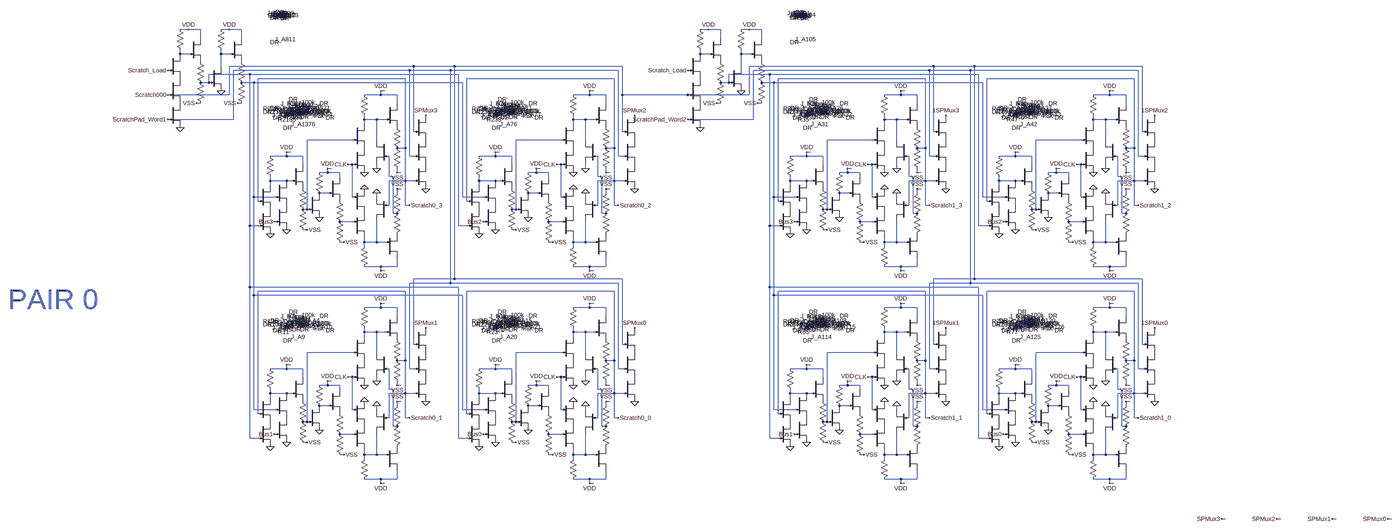
[diagram p0: schematic Pair 1.asc, whole sheet]
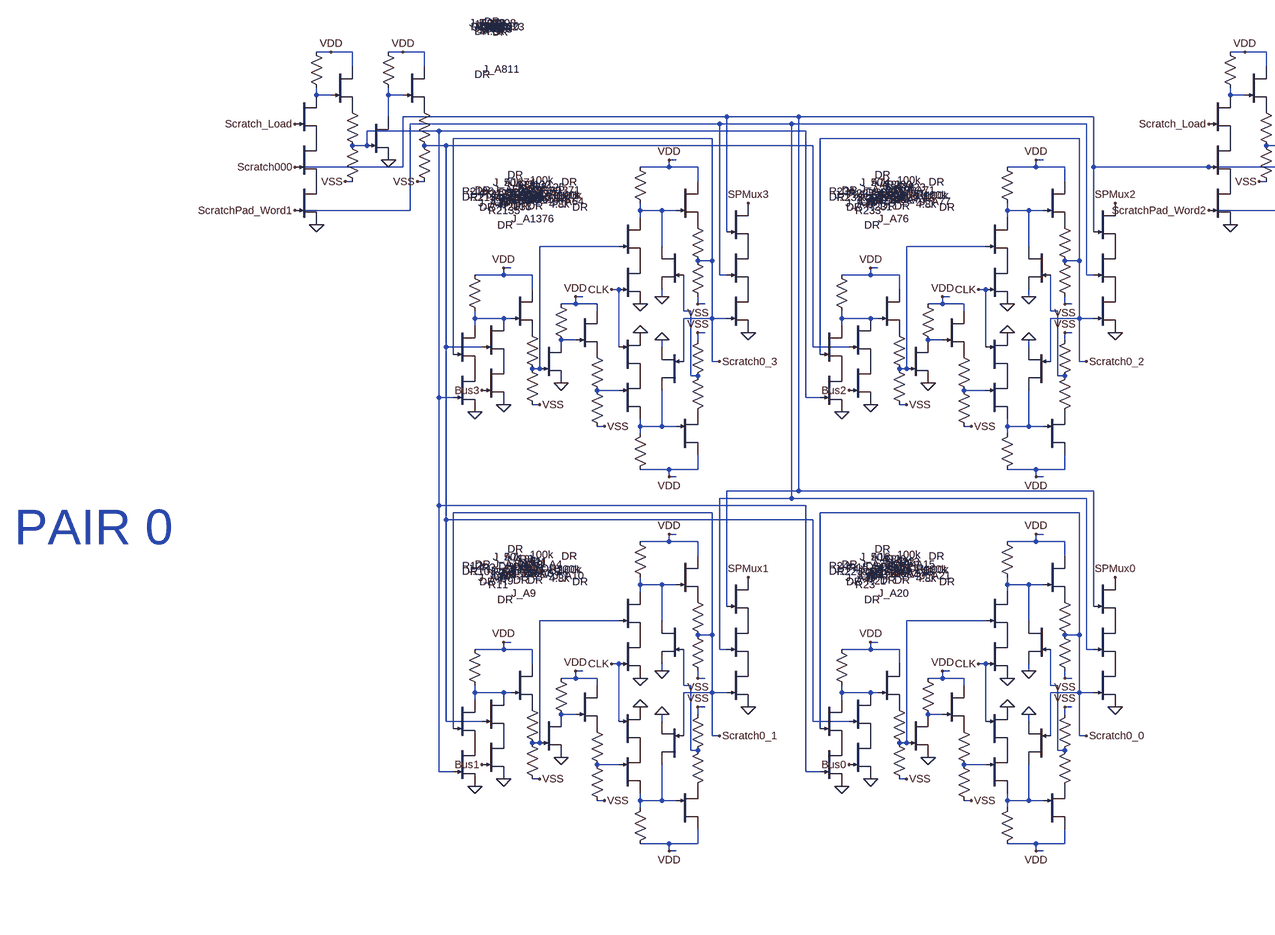
[diagram p1: schematic Pair 1.asc, part, row 1 of 1, column 1 of 2]
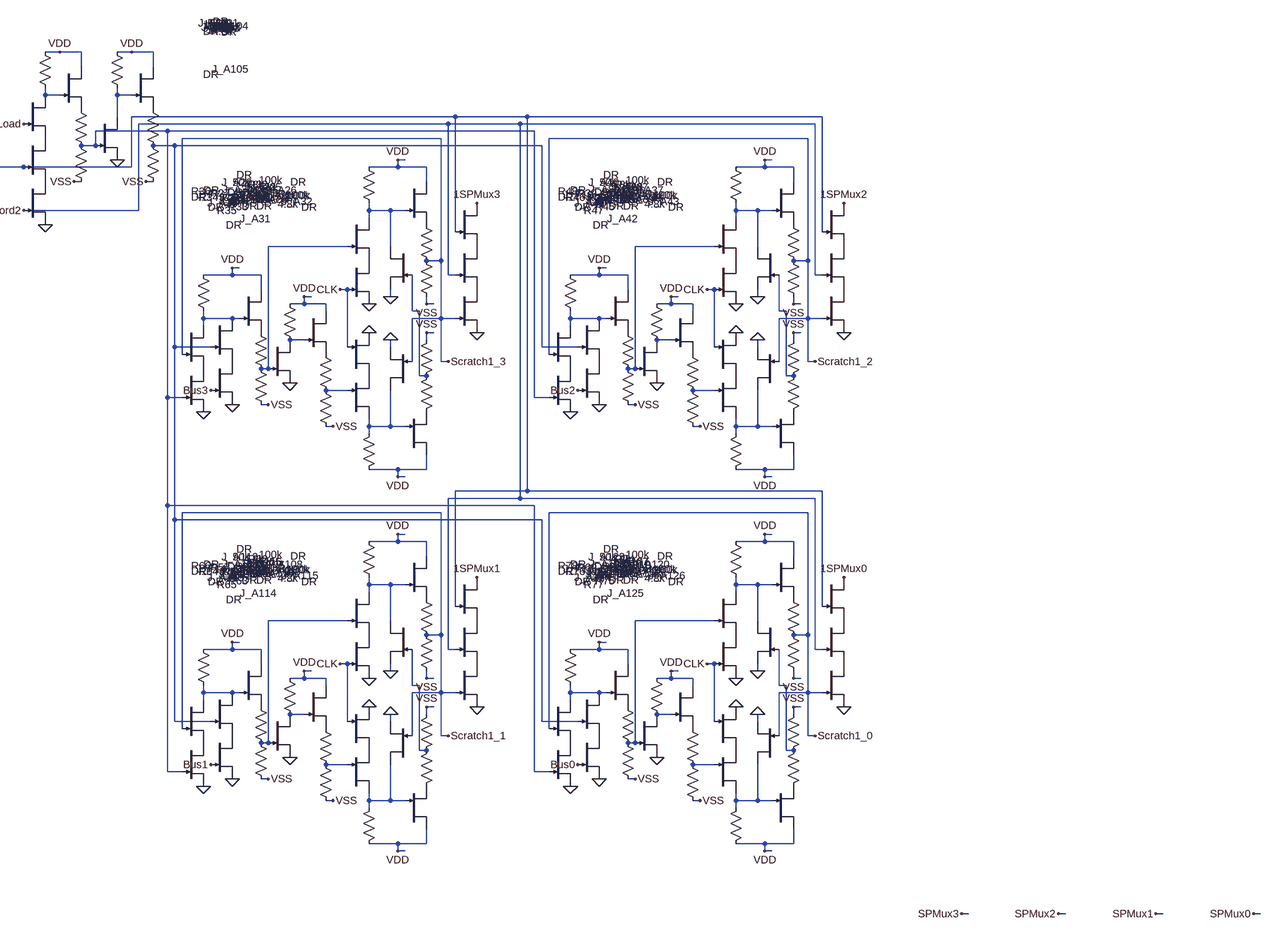
[diagram p2: schematic Pair 1.asc, part, row 1 of 1, column 2 of 2]
* Pair 1.asc
J_A1369 N009 N013 P001 DR
R2125 VDD N009 100k
J_F510 VDD N009 P002 DR
R2126 P002 Scratch0_3 1k
R2127 Scratch0_3 VSS 4.8k
J_B634 N009 N017 0 DR
J_A1370 N033 N029 P003 DR
R2128 VDD N033 100k
J_F511 VDD N033 P004 DR
R2129 P004 N017 1k
R2130 N017 VSS 4.8k
J_B635 N033 Scratch0_3 0 DR
J_A1371 P001 CLK 0 DR
J_A1372 P003 CLK 0 DR
J_A1373 N021 Scratch0_3 P005 DR
R2131 VDD N021 100k
J_F512 VDD N021 P006 DR
R2132 P006 N013 1k
R2133 N013 VSS 4.8k
J_B636 N021 N007 P007 DR
J_A1374 N025 N013 0 DR
R2134 VDD N025 50k
J_A1375 VDD N025 P008 DR
R2135 P008 N029 1k
R2136 N029 VSS 4.5k
J_A1376 P005 N005 0 DR
J_B637 P007 Bus3 0 DR
J_A64 P009 Scratch0_3 0 DR
J_A65 P010 ScratchPad_Word1 P009 DR
J_A66 SPMux3 Scratch000 P010 DR
J_A1 N010 N014 P011 DR
R223 VDD N010 100k
J_F32 VDD N010 P012 DR
R224 P012 Scratch0_2 1k
R225 Scratch0_2 VSS 4.8k
J_B38 N010 N018 0 DR
J_A70 N034 N030 P013 DR
R226 VDD N034 100k
J_F64 VDD N034 P014 DR
R227 P014 N018 1k
R228 N018 VSS 4.8k
J_B39 N034 Scratch0_2 0 DR
J_A71 P011 CLK 0 DR
J_A72 P013 CLK 0 DR
J_A73 N022 Scratch0_2 P015 DR
R229 VDD N022 100k
J_F65 VDD N022 P016 DR
R230 P016 N014 1k
R231 N014 VSS 4.8k
J_B40 N022 N007 P017 DR
J_A74 N026 N014 0 DR
R232 VDD N026 50k
J_A75 VDD N026 P018 DR
R233 P018 N030 1k
R234 N030 VSS 4.5k
J_A76 P015 N005 0 DR
J_B41 P017 Bus2 0 DR
J_A77 P019 Scratch0_2 0 DR
J_A78 P020 ScratchPad_Word1 P019 DR
J_A286 SPMux2 Scratch000 P020 DR
R199 VDD N001 100k
J_F270 VDD N001 P021 DR
R202 P021 N005 1k
R910 N005 VSS 4.8k
J_A807 N002 N005 0 DR
R913 VDD N002 50k
J_A808 VDD N002 P022 DR
R1023 P022 N007 1k
R1024 VSS N007 4.5k
J_A809 N001 Scratch_Load P023 DR
J_A810 P023 Scratch000 P024 DR
J_A811 P024 ScratchPad_Word1 0 DR
J_A2 N037 N041 P025 DR
R1 VDD N037 100k
J_F1 VDD N037 P026 DR
R2 P026 Scratch0_1 1k
R3 Scratch0_1 VSS 4.8k
J_B1 N037 N045 0 DR
J_A3 N061 N057 P027 DR
R4 VDD N061 100k
J_F2 VDD N061 P028 DR
R5 P028 N045 1k
R6 N045 VSS 4.8k
J_B2 N061 Scratch0_1 0 DR
J_A4 P025 CLK 0 DR
J_A5 P027 CLK 0 DR
J_A6 N049 Scratch0_1 P029 DR
R7 VDD N049 100k
J_F3 VDD N049 P030 DR
R8 P030 N041 1k
R9 N041 VSS 4.8k
J_B3 N049 N007 P031 DR
J_A7 N053 N041 0 DR
R10 VDD N053 50k
J_A8 VDD N053 P032 DR
R11 P032 N057 1k
R12 N057 VSS 4.5k
J_A9 P029 N005 0 DR
J_B4 P031 Bus1 0 DR
J_A10 P033 Scratch0_1 0 DR
J_A11 P034 ScratchPad_Word1 P033 DR
J_A12 SPMux1 Scratch000 P034 DR
J_A13 N038 N042 P035 DR
R13 VDD N038 100k
J_F4 VDD N038 P036 DR
R14 P036 Scratch0_0 1k
R15 Scratch0_0 VSS 4.8k
J_B5 N038 N046 0 DR
J_A14 N062 N058 P037 DR
R16 VDD N062 100k
J_F5 VDD N062 P038 DR
R17 P038 N046 1k
R18 N046 VSS 4.8k
J_B6 N062 Scratch0_0 0 DR
J_A15 P035 CLK 0 DR
J_A16 P037 CLK 0 DR
J_A17 N050 Scratch0_0 P039 DR
R19 VDD N050 100k
J_F6 VDD N050 P040 DR
R20 P040 N042 1k
R21 N042 VSS 4.8k
J_B7 N050 N007 P041 DR
J_A18 N054 N042 0 DR
R22 VDD N054 50k
J_A19 VDD N054 P042 DR
R23 P042 N058 1k
R24 N058 VSS 4.5k
J_A20 P039 N005 0 DR
J_B8 P041 Bus0 0 DR
J_A21 P043 Scratch0_0 0 DR
J_A22 P044 ScratchPad_Word1 P043 DR
J_A23 SPMux0 Scratch000 P044 DR
J_A24 N011 N015 P045 DR
R25 VDD N011 100k
J_F7 VDD N011 P046 DR
R26 P046 Scratch1_3 1k
R27 Scratch1_3 VSS 4.8k
J_B9 N011 N019 0 DR
J_A25 N035 N031 P047 DR
R28 VDD N035 100k
J_F8 VDD N035 P048 DR
R29 P048 N019 1k
R30 N019 VSS 4.8k
J_B10 N035 Scratch1_3 0 DR
J_A26 P045 CLK 0 DR
J_A27 P047 CLK 0 DR
J_A28 N023 Scratch1_3 P049 DR
R31 VDD N023 100k
J_F9 VDD N023 P050 DR
R32 P050 N015 1k
R33 N015 VSS 4.8k
J_B11 N023 N008 P051 DR
J_A29 N027 N015 0 DR
R34 VDD N027 50k
J_A30 VDD N027 P052 DR
R35 P052 N031 1k
R36 N031 VSS 4.5k
J_A31 P049 N006 0 DR
J_B12 P051 Bus3 0 DR
J_A32 P053 Scratch1_3 0 DR
J_A33 P054 ScratchPad_Word2 P053 DR
J_A34 1SPMux3 Scratch000 P054 DR
J_A35 N012 N016 P055 DR
R37 VDD N012 100k
J_F10 VDD N012 P056 DR
R38 P056 Scratch1_2 1k
R39 Scratch1_2 VSS 4.8k
J_B13 N012 N020 0 DR
J_A36 N036 N032 P057 DR
R40 VDD N036 100k
J_F11 VDD N036 P058 DR
R41 P058 N020 1k
R42 N020 VSS 4.8k
J_B14 N036 Scratch1_2 0 DR
J_A37 P055 CLK 0 DR
J_A38 P057 CLK 0 DR
J_A39 N024 Scratch1_2 P059 DR
R43 VDD N024 100k
J_F12 VDD N024 P060 DR
R44 P060 N016 1k
R45 N016 VSS 4.8k
J_B15 N024 N008 P061 DR
J_A40 N028 N016 0 DR
R46 VDD N028 50k
J_A41 VDD N028 P062 DR
R47 P062 N032 1k
R48 N032 VSS 4.5k
J_A42 P059 N006 0 DR
J_B36 P061 Bus2 0 DR
J_A43 P063 Scratch1_2 0 DR
J_A88 P064 ScratchPad_Word2 P063 DR
J_A89 1SPMux2 Scratch000 P064 DR
R49 VDD N003 100k
J_F13 VDD N003 P065 DR
R50 P065 N006 1k
R51 N006 VSS 4.8k
J_A90 N004 N006 0 DR
R52 VDD N004 50k
J_A91 VDD N004 P066 DR
R53 P066 N008 1k
R54 VSS N008 4.5k
J_A103 N003 Scratch_Load P067 DR
J_A104 P067 Scratch000 P068 DR
J_A105 P068 ScratchPad_Word2 0 DR
J_A106 N039 N043 P069 DR
R55 VDD N039 100k
J_F14 VDD N039 P070 DR
R56 P070 Scratch1_1 1k
R57 Scratch1_1 VSS 4.8k
J_B37 N039 N047 0 DR
J_A107 N063 N059 P071 DR
R58 VDD N063 100k
J_F15 VDD N063 P072 DR
R59 P072 N047 1k
R60 N047 VSS 4.8k
J_B42 N063 Scratch1_1 0 DR
J_A108 P069 CLK 0 DR
J_A109 P071 CLK 0 DR
J_A110 N051 Scratch1_1 P073 DR
R61 VDD N051 100k
J_F16 VDD N051 P074 DR
R62 P074 N043 1k
R63 N043 VSS 4.8k
J_B43 N051 N008 P075 DR
J_A112 N055 N043 0 DR
R64 VDD N055 50k
J_A113 VDD N055 P076 DR
R65 P076 N059 1k
R66 N059 VSS 4.5k
J_A114 P073 N006 0 DR
J_B44 P075 Bus1 0 DR
J_A115 P077 Scratch1_1 0 DR
J_A116 P078 ScratchPad_Word2 P077 DR
J_A117 1SPMux1 Scratch000 P078 DR
J_A118 N040 N044 P079 DR
R67 VDD N040 100k
J_F17 VDD N040 P080 DR
R68 P080 Scratch1_0 1k
R69 Scratch1_0 VSS 4.8k
J_B45 N040 N048 0 DR
J_A119 N064 N060 P081 DR
R70 VDD N064 100k
J_F18 VDD N064 P082 DR
R71 P082 N048 1k
R72 N048 VSS 4.8k
J_B46 N064 Scratch1_0 0 DR
J_A120 P079 CLK 0 DR
J_A121 P081 CLK 0 DR
J_A122 N052 Scratch1_0 P083 DR
R73 VDD N052 100k
J_F19 VDD N052 P084 DR
R74 P084 N044 1k
R75 N044 VSS 4.8k
J_B47 N052 N008 P085 DR
J_A123 N056 N044 0 DR
R76 VDD N056 50k
J_A124 VDD N056 P086 DR
R77 P086 N060 1k
R78 N060 VSS 4.5k
J_A125 P083 N006 0 DR
J_B48 P085 Bus0 0 DR
J_A126 P087 Scratch1_0 0 DR
J_A127 P088 ScratchPad_Word2 P087 DR
J_A128 1SPMux0 Scratch000 P088 DR
.model NJF NJF
.model PJF PJF
.lib standard.jft
* PAIR 0
.backanno
.end